# EAGLE design SPI_Thermocouple (EAGLE 6.3)
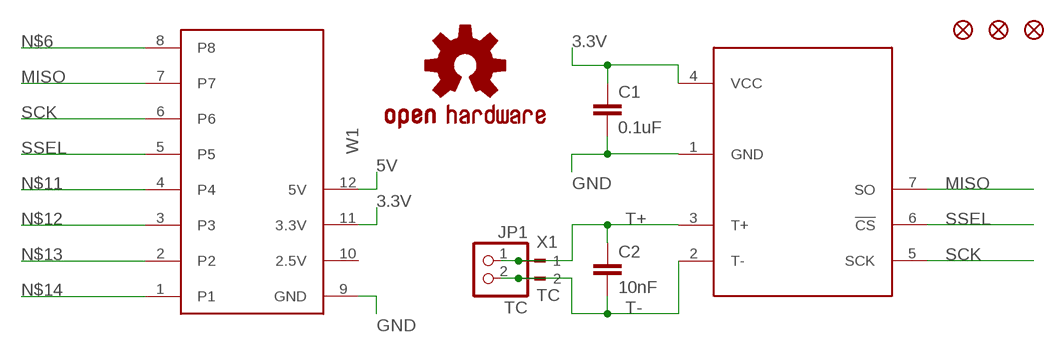
[diagram p0: schematic, sheet 1]

## Parts
C1  0.1uF  CAP1206  [1206]
C2  10nF  CAP0603-CAP  [0603-CAP]
FID1  FIDUCIAL1X2  [FIDUCIAL-1X2]
FID2  FIDUCIAL1X2  [FIDUCIAL-1X2]
FID3  FIDUCIAL1X2  [FIDUCIAL-1X2]
JP1  TC  PINHD-1X2  [1X02]
U1  MAX31855  [SO08]
U$1  OSHW-LOGOS  [OSHW-LOGO-S]
W1  PAPILIO-WING-8BITS  [PAPILIO-WING-8BITS]
X1  TC  180-2  [180-2]

## Nets
3.3V: C1.1 U1.4(VCC) W1.11(3.3V)
5V: W1.12(5V)
GND: C1.2 U1.1(GND) W1.9(GND)
MISO: U1.7(SO) W1.7
N$6: W1.8
N$11: W1.4
N$12: W1.3
N$13: W1.2
N$14: W1.1
SCK: U1.5(SCK) W1.6
SSEL: U1.6(!CS) W1.5
T+: C2.1 JP1.1 U1.3(T+) X1.1
T-: C2.2 JP1.2 U1.2(T-) X1.2
Unconnected: W1.10(2.5V)

## Library data of the parts
C1 C2 = SparkFun-Passives:CAP: Capacitor Standard 0603 ceramic capacitor, and 0.1" leaded capacitor.
FID1-FID3 = SparkFun:FIDUCIAL: Fiducial Alignment Points Various fiducial points for machine vision alignment.
JP1 = pinhead:PINHD-1X2: PIN HEADER
U1 = logxen:MAX31855
U$1 = logxen:OSHW-LOGO: Open Source Hardware Logo This logo indicates the piece of hardware it is found on incorporates a OSHW license and/or adheres to the definition of open source hardware found here: http://freedomdefined.org/OSHW
W1 = logxen:PAPILIO-WING-8BITS
X1 = con-weidmueller-sl35:180-2: WEIDMUELLER CLAMP CONNECTOR; OC_FARNELL: unknown; OC_NEWARK: unknown

## Board
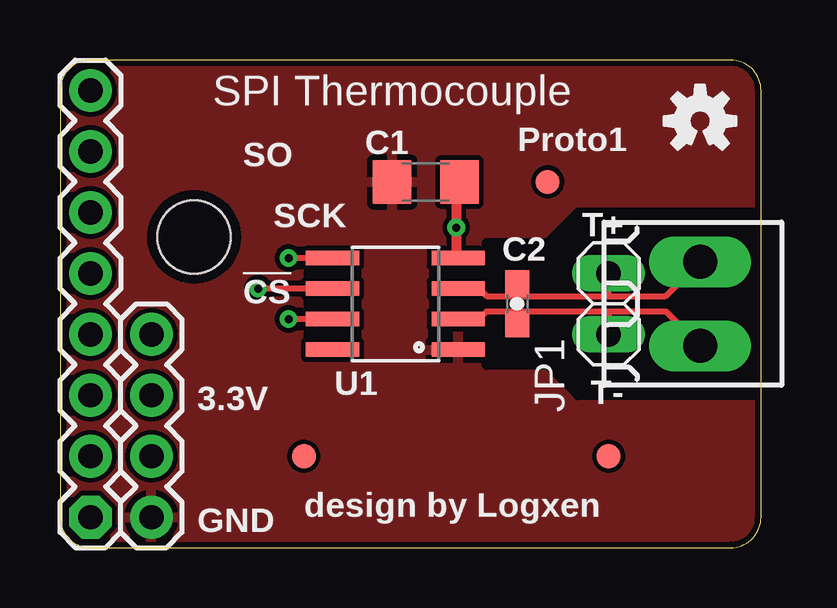
[diagram p1: board, top side]
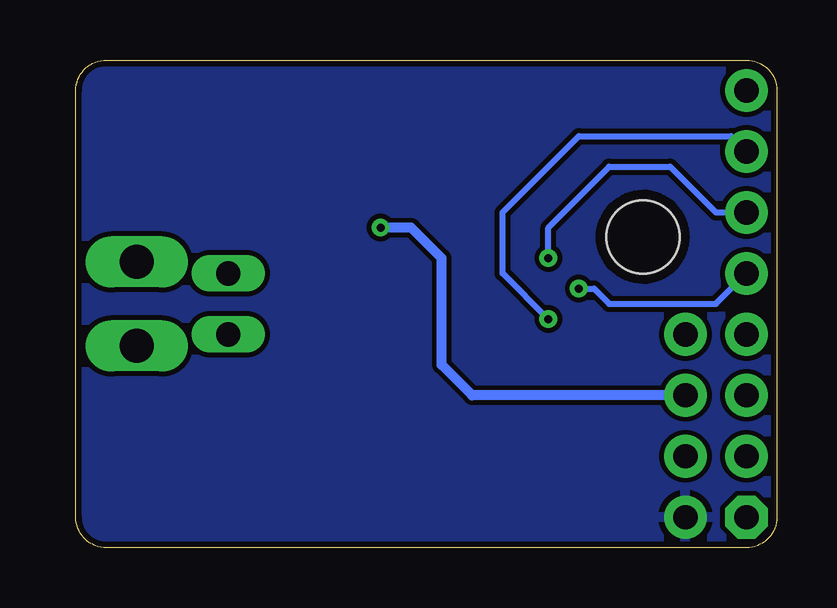
[diagram p2: board, bottom side, seen from below]

Size 29.21 x 20.32 mm. Coordinates in mm from the lower left corner, seen from the top.
Outline: 1.27,0 27.94,0 arc90 29.21,1.27 29.21,19.05 arc90 27.94,20.32 1.27,20.32 arc90 0,19.05 0,1.27 arc90 1.27,0
Copper layers (1*16): Top 0.035mm / dielectric 1.5mm / Bottom 0.035mm
Design rules "logxen-default *": minimum track width 8mil, minimum drill 13mil, track to track 8mil, track to pad 8mil, pad to pad 8mil, via to via 8mil, smd to smd 8mil, copper to edge 10mil, drill to drill 8mil, minimum pad ring 10mil, minimum via ring 8mil, stop-mask expansion 4mil, vias tented up to drill 0mil, thermal gap 10mil

### Footprints (pad centres in the part's own frame; a part is rotated, then mirrored left to right if it is on the bottom)
1206 = smd 1.6 x 1.8: 1 -1.4,0; 2 1.4,0
0603-CAP = smd 1.1 x 1: 1 -0.85,0; 2 0.85,0
FIDUCIAL-1X2 = smd 1 x 1: 1 0,0
1X02 = drill 1.016 long: 1 -1.27,0; 2 1.27,0
SO08 = smd 0.61 x 2.21: 1 -1.905,-2.616; 2 -0.635,-2.616; 3 0.635,-2.616; 4 1.905,-2.616; 5 1.905,2.616; 6 0.635,2.616; 7 -0.635,2.616; 8 -1.905,2.616
PAPILIO-WING-8BITS = drill 1.016 pad 1.778 octagon: 1 0,0 | drill 1.016 pad 1.778: 2 0,2.54; 3 0,5.08; 4 0,7.62; 5 0,10.16; 6 0,12.7; 7 0,15.24; 8 0,17.78; 9 2.54,0; 10 2.54,2.54; 11 2.54,5.08; 12 2.54,7.62 | hole 3.048: 4.318,11.684
180-2 = drill 1.422 long: 1 -1.75,0; 2 1.75,0

### Placement (x,y rotation side)
C1  15.24,15.24 180 top
C2  19.05,10.16 270 top
FID1  22.86,3.81 0 top
FID2  10.16,3.81 0 top
FID3  20.32,15.24 0 top
JP1  22.86,10.16 270 top
U1  13.97,10.16 90 top
U$1  26.67,17.78 0 top
W1  1.27,1.27 0 top
X1  26.67,10.16 270 top

### Tracks (layer width: path | path; a pad name or v marks a point on that pad's centre or on a via)
3.3V  (via drill 0.33)
  Top 0.406: U1.4 16.51,12.14 v16.51,13.34 16.51,15.11 C1.1
  Bottom 0.406: W1.11 12.7,6.35 13.97,7.62 13.97,12.06 15.24,13.34 v16.51,13.34
GND
  pour Top: -1.27,21.59 30.48,21.59 30.48,-1.27 -1.27,-1.27
  pour Bottom: -2.54,22.86 31.75,22.86 31.75,-2.54 -2.54,-2.54
MISO  (via drill 0.33)
  Top 0.254: U1.7 v9.53,9.53
  Bottom 0.254: v9.53,9.53 11.43,11.43 11.43,13.97 8.26,17.14 1.91,17.14 W1.7
N$1
  cutout Top: 17.78,12.7 20.32,12.7 21.59,13.97 33.02,13.97 33.02,6.35 21.59,6.35 20.32,7.62 17.78,7.62
SCK  (via drill 0.33)
  Top 0.254: U1.5 v9.53,12.06
  Bottom 0.254: v9.53,12.06 9.53,13.34 6.99,15.88 4.45,15.88 2.54,13.97 W1.6
SSEL  (via drill 0.33)
  Top 0.254: U1.6 v8.26,10.79
  Bottom 0.254: v8.26,10.79 7.62,10.79 6.99,10.16 2.54,10.16 W1.5
T+
  Top 0.254: U1.3 17.46,10.79 17.78,10.48 19.05,10.48 | 19.05,10.48 C2.1 | 19.05,10.48 22.86,10.48 | 22.86,10.48 JP1.1 | 22.86,10.48 25.24,10.48 X1.1
T-
  Top 0.254: U1.2 17.46,9.53 17.78,9.84 19.05,9.84 | 19.05,9.84 C2.2 | 19.05,9.84 22.86,9.84 | 22.86,9.84 JP1.2 | 22.86,9.84 25.24,9.84 X1.2

### Text on the board
tPlace: SPI Thermocouple | Proto1 | SO | T+ | SCK | !CS | T- | 3.3V | GND | design by Logxen